# Altium schematic sheet SCH_Sensor_Node.SchDoc
size A4; SheetNumber: 1; SheetTotal: 1
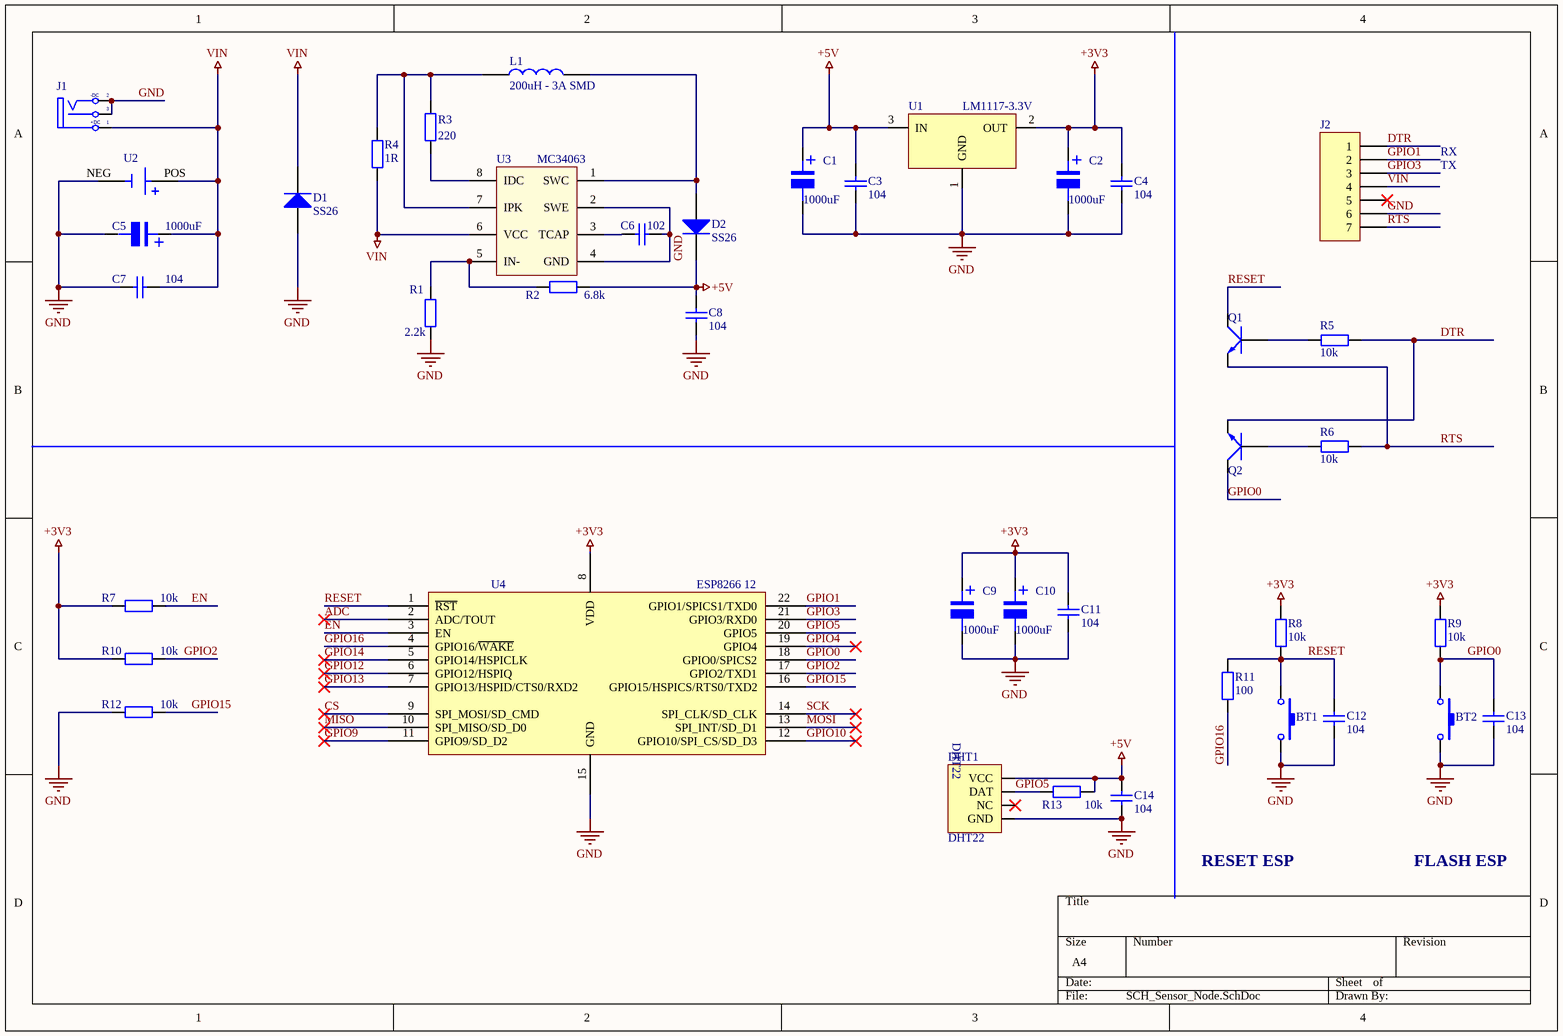
[diagram p0: SCH_Sensor_Node.SchDoc]

## Parts
BT1  Nut Nhan 2 Chan SMD 3x6x2.5  [Nut Nhan 2 Chan SMD 3x6x2.5]  (value not drawn)
BT2  Nut Nhan 2 Chan SMD 3x6x2.5  [Nut Nhan 2 Chan SMD 3x6x2.5]  (value not drawn)
C1  1000uF  [tu nhom 10 (G)]
C2  1000uF  [tu nhom 10 (G)]
C3  104  [tu 0805]
C4  104  [tu 0805]
C5  1000uF  [tu nhom 10 (G)]
C6  102  [tu 0805]
C7  104  [tu 0805]
C8  104  [tu 0805]
C9  1000uF  [tu nhom 10 (G)]
C10  1000uF  [tu nhom 10 (G)]
C11  104  [tu 0805]
C12  104  [tu 0805]
C13  104  [tu 0805]
C14  104  [tu 0805]
D1  SS26  [CAPM4336X25N]
D2  SS26  [CAPM4336X25N]
DHT1  DHT22  [DHT22-SMD]
J1  JACK DC 5.5  [JACK DC 5.5]  (value not drawn)
J2  Header 7  [HDR1X7]  (value not drawn)
L1  200uH - 3A SMD  [Cuon Cam 12x12x10]
Q1  HF  [SOT23]  (value not drawn)
Q2  HF  [SOT23]  (value not drawn)
R1  2.2k  [tro smd 0805]
R2  6.8k  [tro smd 0805]
R3  220  [tro smd 0805]
R4  1R  [tro smd 0805]
R5  10k  [tro smd 0805]
R6  10k  [tro smd 0805]
R7  10k  [tro smd 0805]
R8  10k  [tro smd 0805]
R9  10k  [tro smd 0805]
R10  10k  [tro smd 0805]
R11  100  [tro smd 0805]
R12  10k  [tro smd 0805]
R13  10k  [tro smd 0805]
U1  LM1117-3.3V  [SOT223]
U2  BK-18650-PC2  [BAT_BK-18650-PC2]  (value not drawn)
U3  MC34063  [SOIC127P600X175-8N]
U4  ESP8266 12  [ESP8266 12]

## Nets
+3V3: C2.1 C4.1 C9.1 C10.1 C11.1 R7.2 R8.2 R9.2 R10.2 U1.2(OUT) U4.8(VDD)
+5V: C1.1 C3.1 C8.1 C14.1 D2.2(K) DHT1.1(VCC) R2.1 R13.1 U1.3(IN)
GND: BT1.2 BT2.2 C1.2 C2.2 C3.2 C4.2 C5.2 C6.1 C7.1 C8.2 C9.2 C10.2 C11.2 C12.2 C13.2 C14.2 D1.1(A) DHT1.4(GND) J1.2(TN) J1.3(S) J2.6 R1.2 R12.2 U1.1(GND) U2.NEG U3.2(SWE) U3.4(GND) U4.15(GND)
VIN: C5.1 C7.2 D1.2(K) J1.1(T) J2.4 R4.1 U2.POS U3.6(VCC)
ADC: U4.2(ADC/TOUT)
CS: U4.9(SPI_MOSI/SD_CMD)
DTR: J2.1 Q2.2(E) R5.1
EN: R7.1 U4.3(EN)
GPIO0: BT2.1 C13.1 Q2.3(C) R9.1 U4.18(GPIO0/SPICS2)
GPIO1: J2.2 U4.22(GPIO1/SPICS1/TXD0)
GPIO2: R10.1 U4.17(GPIO2/TXD1)
GPIO3: J2.3 U4.21(GPIO3/RXD0)
GPIO4: U4.19(GPIO4)
GPIO5: DHT1.2(DAT) R13.2 U4.20(GPIO5)
GPIO9: U4.11(GPIO9/SD_D2)
GPIO10: U4.12(GPIO10/SPI_CS/SD_D3)
GPIO12: U4.6(GPIO12/HSPIQ)
GPIO13: U4.7(GPIO13/HSPID/CTS0/RXD2)
GPIO14: U4.5(GPIO14/HSPICLK)
GPIO15: R12.1 U4.16(GPIO15/HSPICS/RTS0/TXD2)
GPIO16: R11.1 U4.4(GPIO16/~{WAKE})
MISO: U4.10(SPI_MISO/SD_D0)
MOSI: U4.13(SPI_INT/SD_D1)
RESET: BT1.1 C12.1 Q1.3(C) R8.1 R11.2 U4.1(~{RST})
RTS: J2.7 Q1.2(E) R6.1
SCK: U4.14(SPI_CLK/SD_CLK)
NetC6_2: C6.2 U3.3(TCAP)
NetD2_1: D2.1(A) L1.2 U3.1(SWC)
NetL1_1: L1.1 R3.1 R4.2 U3.7(IPK)
NetQ1_1: Q1.1(B) R5.2
NetQ2_1: Q2.1(B) R6.2
NetR1_1: R1.1 R2.2 U3.5(IN-)
NetR3_2: R3.2 U3.8(IDC)

Not connected (* = marked no-connect by the designer): DHT1 3(NC)*; J2 5*

## Notes on the sheet
- TX
- RX
- RESET ESP
- FLASH ESP
- (in symbol JACK DC 5.5) -DC; +DC
- (in symbol Tu Nhom 1000uF 10V) +

## Library data of the parts
BT1 BT2 = Nut Nhan 2 Chan SMD 3x6x2.5: Ma_Hang: MH001036; Ten: Nút Nhấn 2 Chân 3x6x2.5MM SMD
C1 C2 C5 C9 C10 = Tu Nhom 1000uF 10V: Dán; So_Chan: 2; Don_Vi: Con; Ten_Linh_Kien: Tụ Nhôm 1000uF 10V; Ma_Hang: MH007515; Chung_Loai: Dán; Kieu_Chan: *
C3 C4 C7 C8 C11-C14 = Tu 0805 104 50V 10%: Dán; Don_Vi: Con; So_Chan: 2; Ten_Linh_Kien: Tụ 0805 104-100nF 10% 50V; Ma_Hang: MH004551; Chung_Loai: Dán; Kieu_Chan: *
C6 = Tu 0805 102 50V 10%: Dán; Don_Vi: Con; So_Chan: 2; Ten_Linh_Kien: Tụ 0805 102-1nF 10% 50V; Ma_Hang: MH004549; Chung_Loai: Dán; Kieu_Chan: *
D1 D2 = Diode SS26: Dán; Ma_Hang: MH002211; Don_Vi: Con; Ten_Linh_Kien: Diode SS14 DO214 Schottky 1A 40V ( 1N5819 DO214); Chung_Loai: Dán; Ghi_Chu: *; Kieu_Chan: *
DHT1 = DHT22: Manufacturer: W¨¹rth Elektronik eiSos GmbH; partNo: 613004143121; ComponentLink1 Description: Manufacturer; ComponentLink2 Description: Datasheet; NoPins: 04; Created Date: 29 March 2013; ComponentLink1URL: http://www.we-online.com; ComponentLink2URL: http://katalog.we-online.de/em/datasheet/6130xx143121.pdf; Created by: Karrer Zheng
J1 = JACK DC 5.5: Value: Jac DC
J2 = Header 7: Header, 7-Pin; LatestRevisionDate: 17-Jul-2002; LatestRevisionNote: Re-released for DXP Platform.; Publisher: Altium Limited
L1 = CUON CAM 100uH SMD: Dán; Don_Vi: Con; Ma_Hang: MH003999; Ten_Linh_Kien: Cuộn Cảm 100uH 7x7x4MM CD74; Ma_Hang: *; Kieu_Chan: *; Chung_Loai: Dán
Q1 Q2 = C1815 HF SMD: NPN transistor; Value: C9014
R1-R3 R5-R10 R12 R13 = Tro 0805 1% 10k: Dán; Don_Vi: Con; So_Chan: 2; Ten_Linh_Kien: Trở 0805 1% 10k; Ma_Hang: MH005473; Chung_Loai: Dán; Kieu_Chan: *
R4 = Tro 0805 1% 1R: Dán; Don_Vi: Con; So_Chan: 2; Ten_Linh_Kien: Trở 0805 1% 1R; Ma_Hang: MH004177; Chung_Loai: Dán; Kieu_Chan: *
R11 = Tro 0805 5% 100R: Dán; Don_Vi: Con; So_Chan: 2; Ten_Linh_Kien: Trở 0805 5% 100R; Ma_Hang: MH005251; Chung_Loai: Dán; Kieu_Chan: *
U1 = LM1117: 800mA Low-Dropout Linear Regulator; Creator: Nguyen Ba Bien; Website: http://group3i.net
U2 = BK-18650-PC2: Battery Holder _Open_ 18650 1 Cell PC Pin; MF: MPD; MP: BK-18650-PC2; Availability: Unavailable; Package: None; Value: *; Price: None; SnapEDA_Link: https://www.snapeda.com/parts/BK-18650-PC2/MPD/view-part/4480461/?ref=snap
U4 = ESP8266 12: ESP8266 12 22 Pin; IC: ESP8266-EX; Vendor: Ai-thinker